# EAGLE schematic rj45-breakout-1.0 (EAGLE 9.6.1)
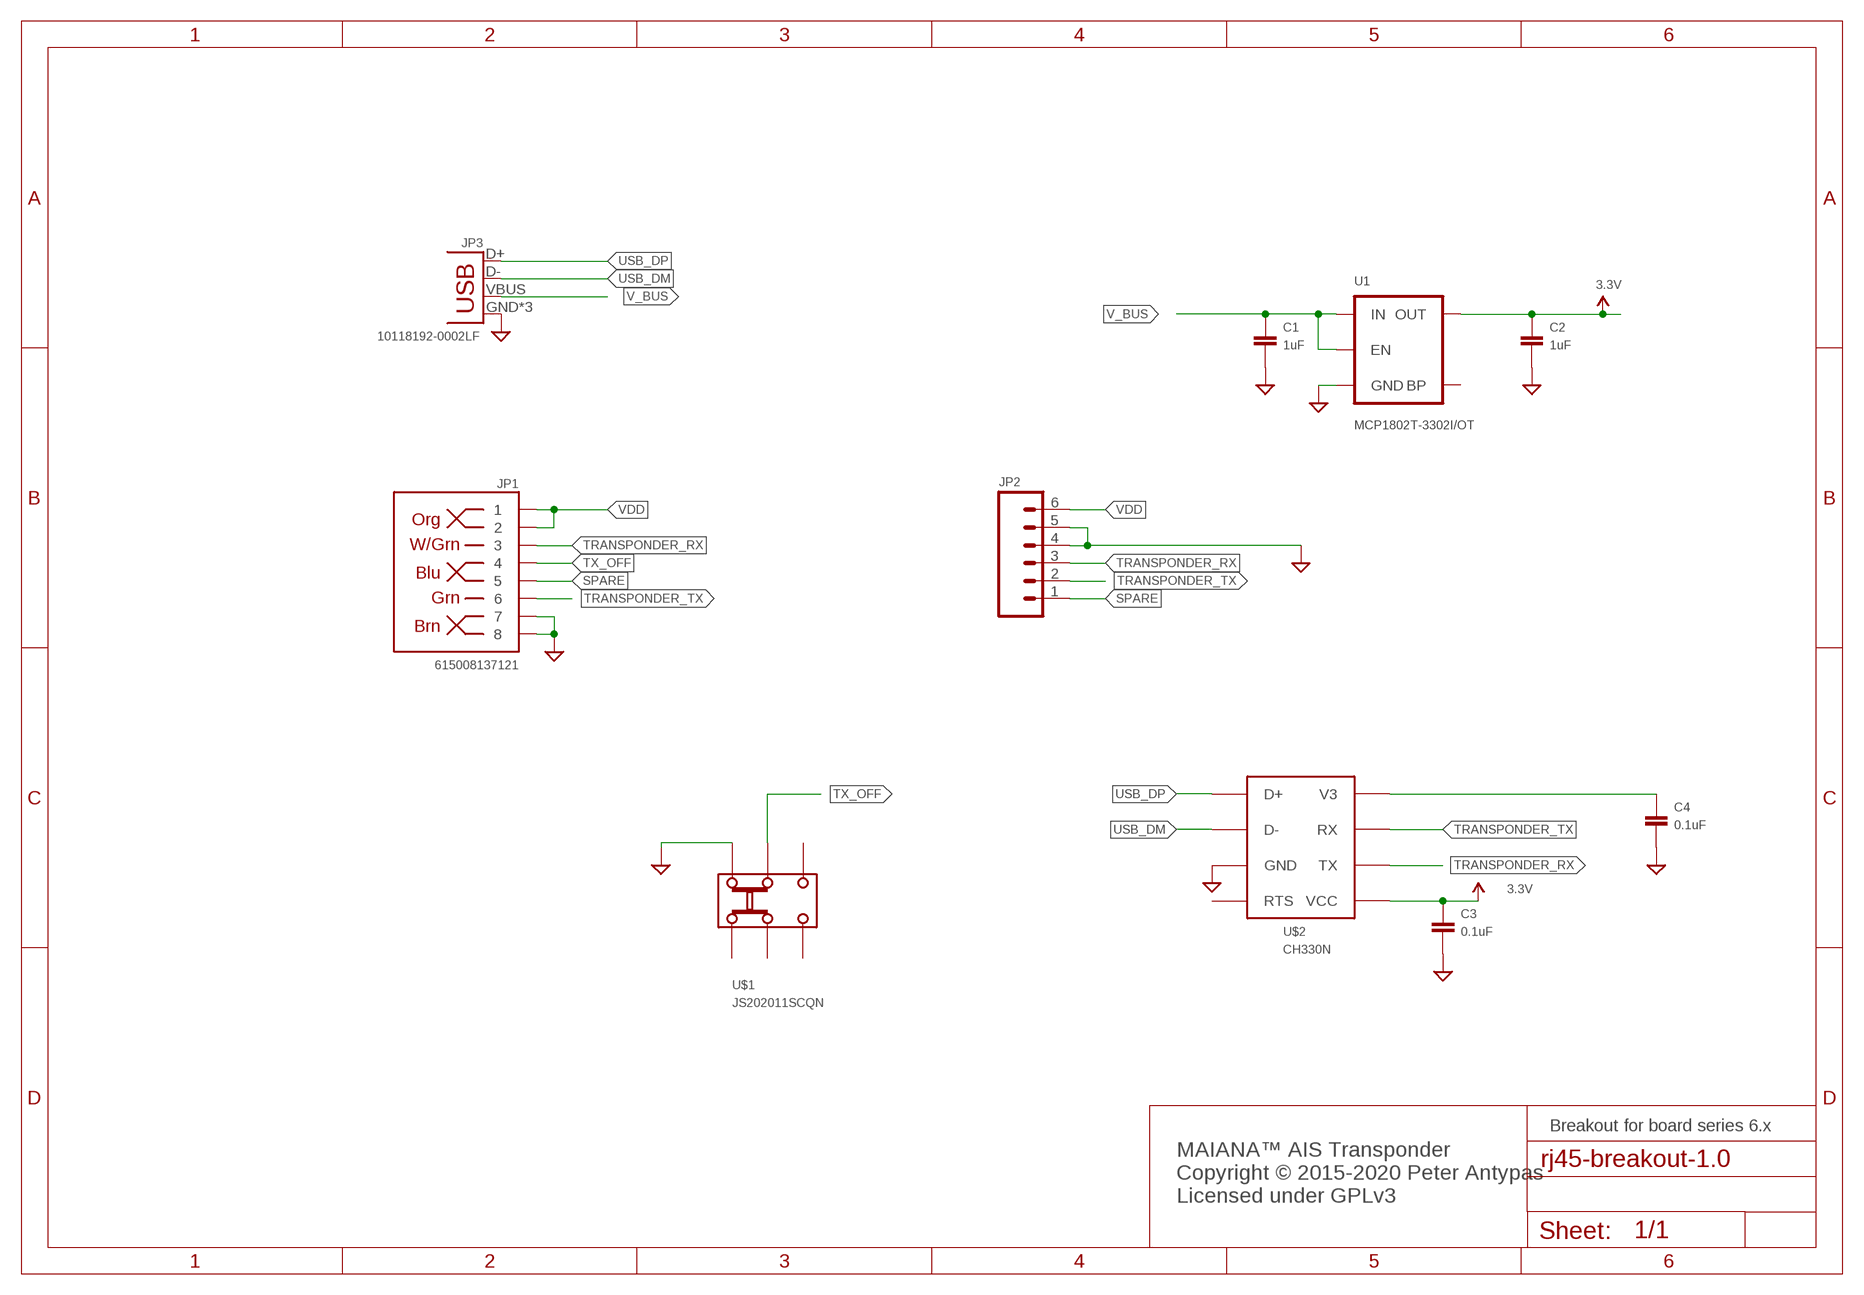
[diagram p0: schematic, sheet 1]

## Parts
C1  1uF  CAPACITOR0603  [0603]
C2  1uF  CAPACITOR0603  [0603]
C3  0.1uF  CAPACITOR0603  [0603]
C4  0.1uF  CAPACITOR0603  [0603]
JP1  615008137121  RJ45-8PTH  [RJ45-8]
JP2  M06SILK_FEMALE_PTH  [1X06]
JP3  10118192-0002LF  USB-MICROB  [USB-MICROB]
U1  MCP1802T-3302I/OT  V_REG_LDOSMD  [SOT23-5]
U$1  JS202011SCQN  [DPDT-SMD]
U$2  CH330N  [SOIC-8]

## Nets
3.3V: C2.P$1 C3.P$1 U1.5(OUT) U$2.5(VCC)
GND: C1.P$2 C2.P$2 C3.P$2 C4.P$2 JP1.7 JP1.8 JP2.4 JP2.5 JP3.GND JP3.MT1(GND) JP3.MT2(GND) U1.2(GND) U$1.P$6 U$2.3(GND)
N$1: C4.P$1 U$2.8(V3)
SPARE: JP1.5 JP2.1
TRANSPONDER_RX: JP1.3 JP2.3 U$2.6(TX)
TRANSPONDER_TX: JP1.6 JP2.2 U$2.7(RX)
TX_OFF: JP1.4 U$1.P$5
USB_DM: JP3.D- U$2.2(D-)
USB_DP: JP3.D+ U$2.1(D+)
V_BUS: C1.P$1 JP3.VBUS U1.1(IN) U1.3(EN)
VDD: JP1.1 JP1.2 JP2.6
Unconnected: U1.4(BP) U$1.P$1 U$1.P$2 U$1.P$3 U$1.P$4 U$2.4(RTS)

## Notes on the sheet
- Breakout for board series 6.x
- MAIANA™ AIS Transponder
  Copyright © 2015-2020 Peter Antypas
  Licensed under GPLv3

## Library data of the parts
C1-C4 = MyPassives:CAPACITOR: Standard SMD capacitor
JP1 = SparkFun-Connectors:RJ45-8: RJ45 Jack Simple RJ45, 8-pin connection - connector for common Cat5, Cat5e, and Cat6 Ethernet cables. Footprint not yet proven in production. Connector sku is PRT-00643; Breakout PCB sku is BOB-00716.; PROD_ID: CONN-08506; VALUE: RJ45
JP2 = SparkFun-Connectors:M06: Header 6 Standard 6-pin 0.1" header. Use with straight break away headers (SKU : PRT-00116), right angle break away headers (PRT-00553), swiss pins (PRT-00743), machine pins (PRT-00117), and female headers (PRT-00115). Molex polarized connector foot print use with SKU : PRT-08094 with associated crimp pins and housings. NOTES ON THE VARIANTS LOCK and LOCK_LONGPADS... This footprint was designed to help hold the alignment of a through-hole component (i.e. 6-pin header) while soldering it into place. You may notice that each hole has been shifted either up or down by 0.005 of an inch from it's more standard position (which is a perfectly straight line). This slight alteration caused the pins (the squares in the middle) to touch the edges of the holes. Because they are alternating, it causes a "brace" to hold the component in place. 0.005 has proven to be the perfect amount of "off-center" position when using our standard breakaway headers. Although looks a little odd when you look at the bare footprint, once you have a header in there, the alteration is very hard to notice. Also,if you push a header all the way into place, it is covered up entirely on the bottom side. This idea of altering the position of holes to aid alignment will be further integrated into the Sparkfun Library for other footprints. It can help hold any component with 3 or more connection pins.; PROD_ID: CONN-08437
JP3 = SparkFun-Connectors:USB: USB Connectors USB-B-PTH is fully proven SKU : PRT-00139/CONN-08278 USB-miniB is fully proven SKU : PRT-00587 USB-A-PCB is untested. USB-A-H is throughly reviewed, but untested. Spark Fun Electronics SKU : PRT-00437 USB-B-SMT is throughly reviewed, but untested. Needs silkscreen touching up. USB-A-S has not been used/tested USB-MB-H has not been used/tested USB-MICROB has been used. CONN-09505; PROD_ID: CONN-09505
U1 = SparkFun-PowerIC:V_REG_LDO: Voltage Regulator LDO Standard 150mA LDO voltage regulator in SOT-23 layout. Micrel part MIC5205. BP (by-pass) pin is used to lower output noise with 470pF cap.
U$1 = slide-switches:JS202011SCQN: DPDT Slide Switch, 300mA 6V
U$2 = JiangsuQinHeng:CH330N: USB to UART bridge